# EAGLE design IR Sensor (EAGLE 9.6.2)
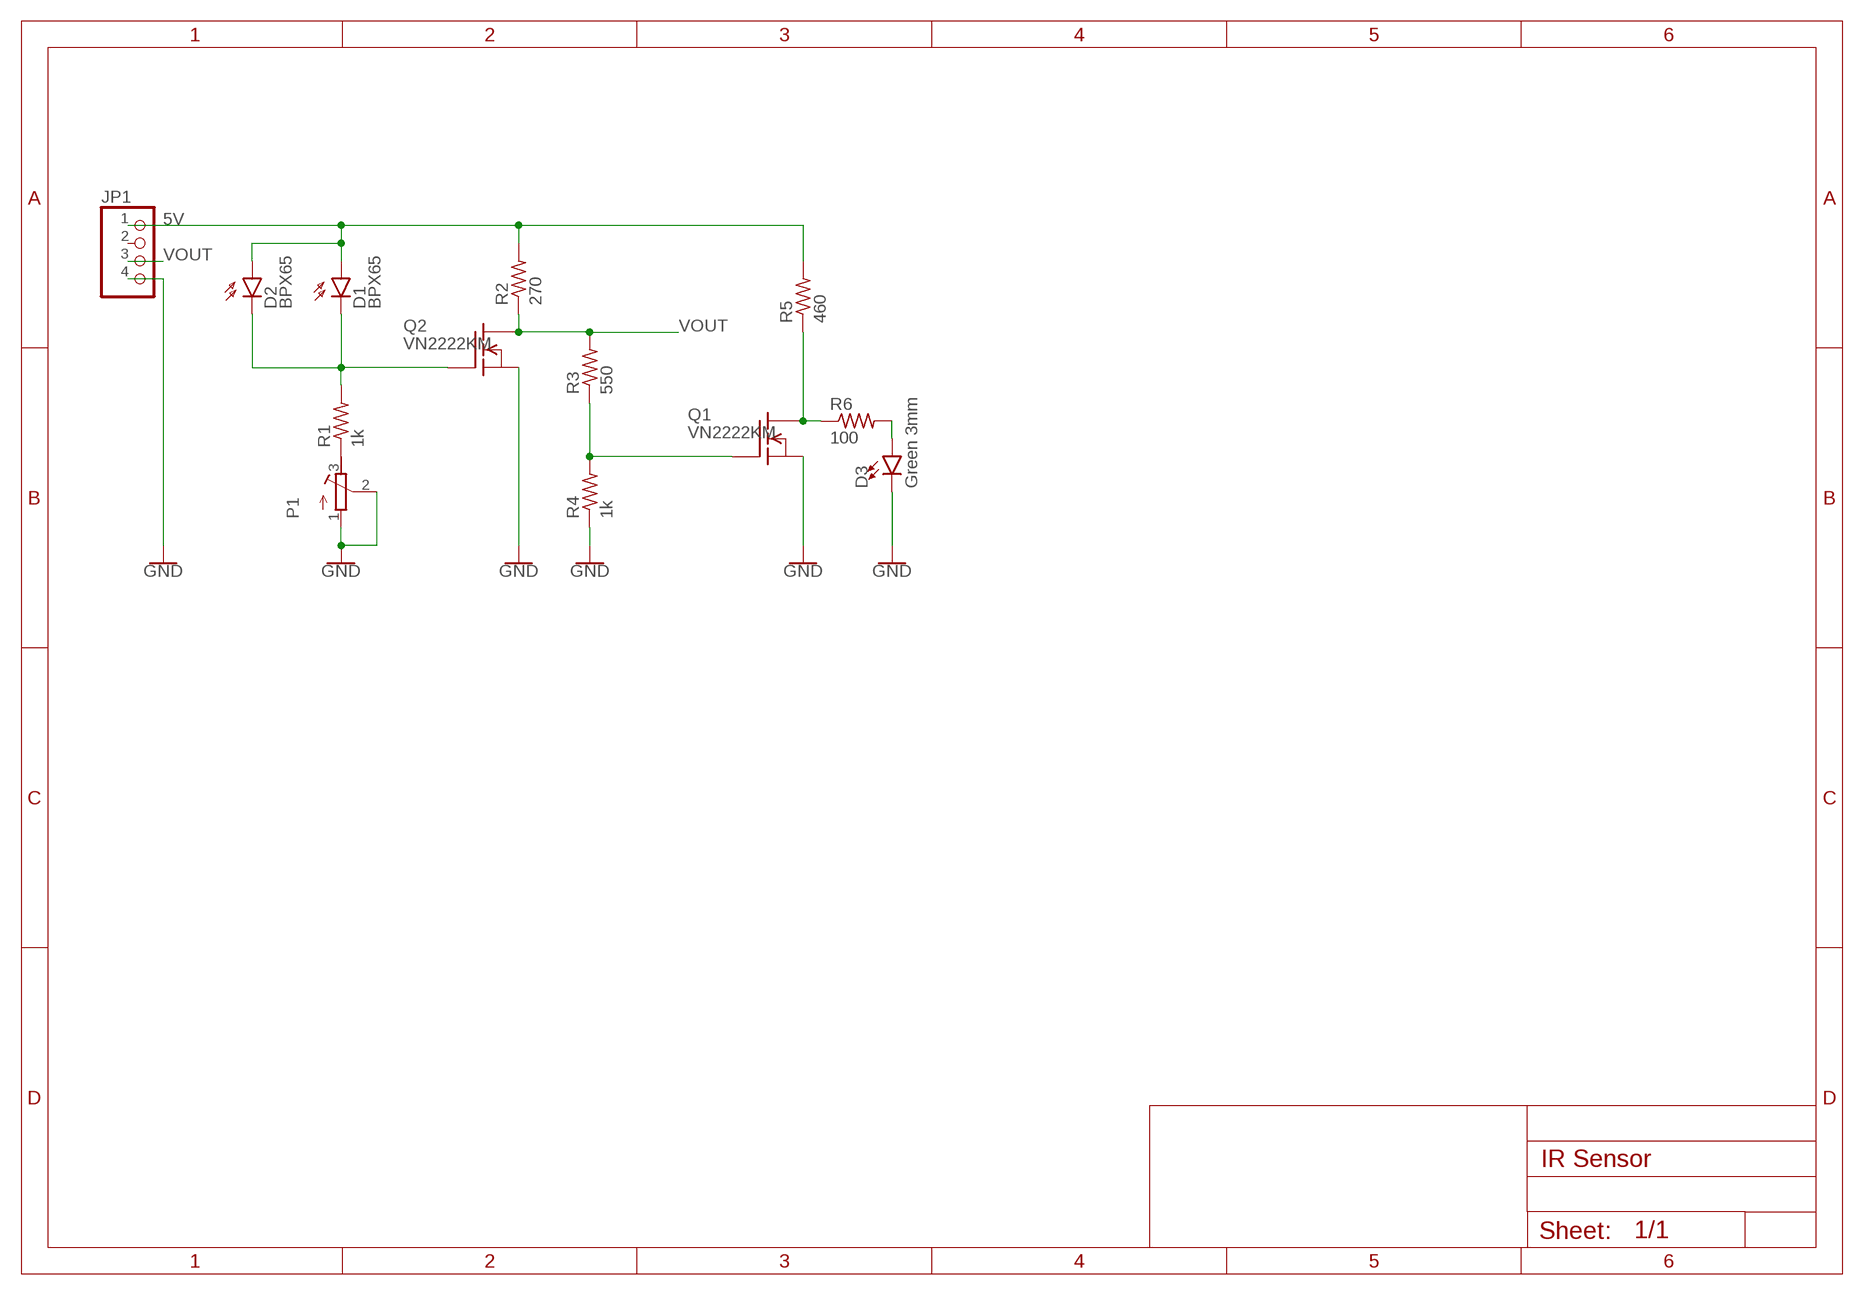
[diagram p0: schematic, sheet 1]

## Parts
D1  BPX65  [BPX65]
D2  BPX65  [BPX65]
D3  Green 3mm  LED3MM  [LED_3MM]
JP1  PINHD-1X4  [1X04]
P1  R-TRIMM64W  [RTRIM64W]
Q1  VN2222KM  [TO237]
Q2  VN2222KM  [TO237]
R1  1k  R-US_0204/7  [0204/7]
R2  270  R-US_0204/7  [0204/7]
R3  550  R-US_0204/7  [0204/7]
R4  1k  R-US_0204/7  [0204/7]
R5  460  R-US_0204/7  [0204/7]
R6  100  R-US_0204/7  [0204/7]

## Nets
5V: D1.A D2.A JP1.1 R2.2 R5.2
GND: D3.K(C) JP1.4 P1.1(A) P1.2(S) Q1.3(S) Q2.3(S) R4.1
N$1: P1.3(E) R1.1
N$2: D1.K(C) D2.K(C) Q2.2(G) R1.2
N$3: Q1.2(G) R3.1 R4.2
N$9: D3.A R6.2
N$10: Q1.1(D) R5.1 R6.1
VOUT: JP1.3 Q2.1(D) R2.1 R3.2
Unconnected: JP1.2

## Library data of the parts
D1 D2 = opto-trans-siemens:BPX65: PHOTO DIODE; MPN: BPX65.; OC_FARNELL: 327451; OC_NEWARK: 06WX2764
D3 = SparkFun-LED:LED: LED (Generic) Standard schematic elements and footprints for 5mm, 3mm, 1206, and 0603 sized LEDs. Generic LEDs with no color specified.; PROD_ID: DIO-08794
JP1 = pinhead:PINHD-1X4: PIN HEADER
P1 = rcl:R-TRIMM: Trimm resistor; SPICEMODEL: X; SPICEPREFIXL: POT
Q1 Q2 = transistor-fet:VN2222KM: N-Channel Enhancement MOSFET (VMOS); 60V; 0,5A; 7,5Ohm
R1-R6 = rcl:R-US_: RESISTOR, American symbol; SPICEPREFIX: R

## Board
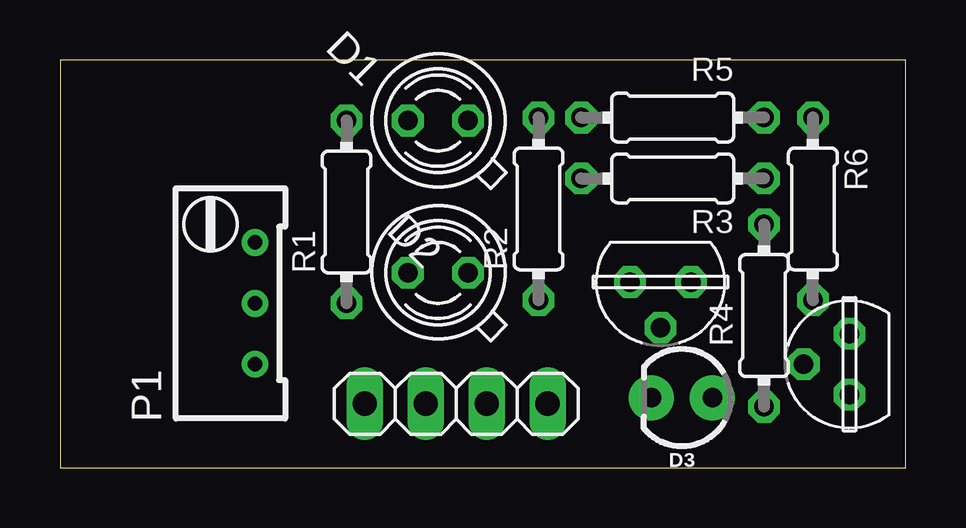
[diagram p1: board, top side]
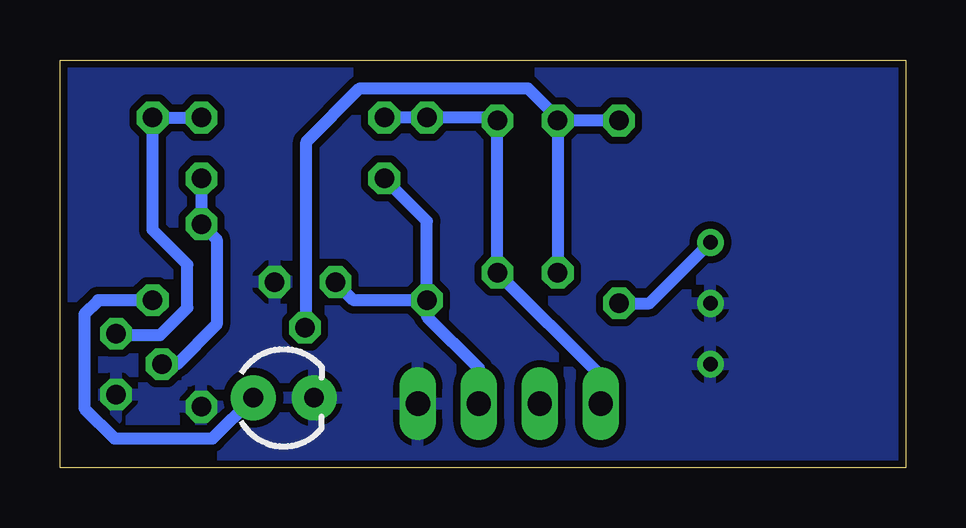
[diagram p2: board, bottom side, seen from below]

Size 35.23 x 17.01 mm. Coordinates in mm from the lower left corner, seen from the top.
Outline: 0,0 35.23,0 35.23,17.01 0,17.01 0,0
Copper layers (1*16): Top 0.035mm / dielectric 1.5mm / Bottom 0.035mm
Design rules "elcdrc": minimum track width 12mil, minimum drill 0.3mm, track to track 12mil, track to pad 12mil, pad to pad 12mil, via to via 12mil, smd to smd 6mil, copper to edge 12mil, drill to drill 12mil, minimum pad ring 10mil, minimum via ring 8mil, stop-mask expansion 4mil, vias tented up to drill 0mil, thermal gap 10mil

### Footprints (pad centres in the part's own frame; a part is rotated, then mirrored left to right if it is on the bottom)
BPX65 = drill 0.813 octagon: A -0.889,-0.889; K 0.889,0.889
LED_3MM = drill 0.813 pad 1.88: A -1.27,0; K 1.27,0
1X04 = drill 1.016 long: 1 -3.81,0; 2 -1.27,0; 3 1.27,0; 4 3.81,0
RTRIM64W = drill 0.61: 1 1.27,-2.54; 2 1.27,0; 3 1.27,2.54
TO237 = drill 0.813 octagon: 1 1.27,0; 2 0,1.905; 3 -1.27,0
0204/7 = drill 0.813 octagon: 1 -3.81,0; 2 3.81,0

### Placement (x,y rotation side)
D1  15.75,14.48 135 top
D2  15.75,8.13 135 top
D3  25.91,2.92 180 top
JP1  16.51,2.67 0 top
P1  6.86,6.86 0 top
Q1  32.89,4.32 90 top
Q2  25.02,7.75 180 top
R1  11.94,10.67 90 top
R2  19.94,10.79 90 top
R3  25.53,12.06 180 top
R4  29.34,6.35 90 top
R5  25.53,14.61 180 top
R6  31.37,10.79 270 top

### Tracks (layer width: path | path; a pad name or v marks a point on that pad's centre or on a via)
5V
  Bottom 0.508: R5.2 R2.2 17.13,14.61 D1.A D2.A 12.7,3.82 JP1.1
GND
  pour Bottom: -0.76,18.29 -0.76,-0.76 36.07,-0.76 36.07,18.29
N$1
  Bottom 0.508: R1.1 10.67,6.86 P1.3
N$2
  Bottom 0.508: D1.K D2.K | Q2.2 24.97,5.89 24.97,13.59 22.73,15.82 15.74,15.82 14.49,14.58 D1.K | R1.2 D1.K
N$3
  Bottom 0.508: R3.1 R4.2 28.7,9.53 28.7,5.97 30.35,4.32 Q1.2
N$9
  Bottom 0.508: R6.2 33.64,6.98 34.21,6.41 34.21,2.48 32.95,1.22 28.88,1.22 D3.A
N$10
  Bottom 0.508: Q1.1 32.84,5.54 31.05,5.54 29.92,6.67 29.92,8.47 31.37,9.92 R6.1 R5.1
VOUT
  Bottom 0.508: R2.1 22.99,6.98 Q2.1 | R2.1 19.94,10.29 R3.2 | R2.1 19.94,6.31 17.78,4.15 JP1.3